# Altium schematic sheet Schematic_Kpad.SchDoc: Kpad
size 431 x 279 mm; ENG_APP_DATE: 04/28/25; DSN_APP_DATE: 04/28/25; CHK_APP_DATE: 04/28/25; ApprovedBy: A Chernyakov; CheckedBy: A Chernyakov; Author: Kai Hokanson; DrawnBy: Kai Hokanson; Engineer: Kai Hokanson; Revision: 1; SheetNumber: 1; SheetTotal: 1; SchematicRevision: 1; CourseNumber: DRAFT 227; CourseTItle: Printed Circuit Board Design II
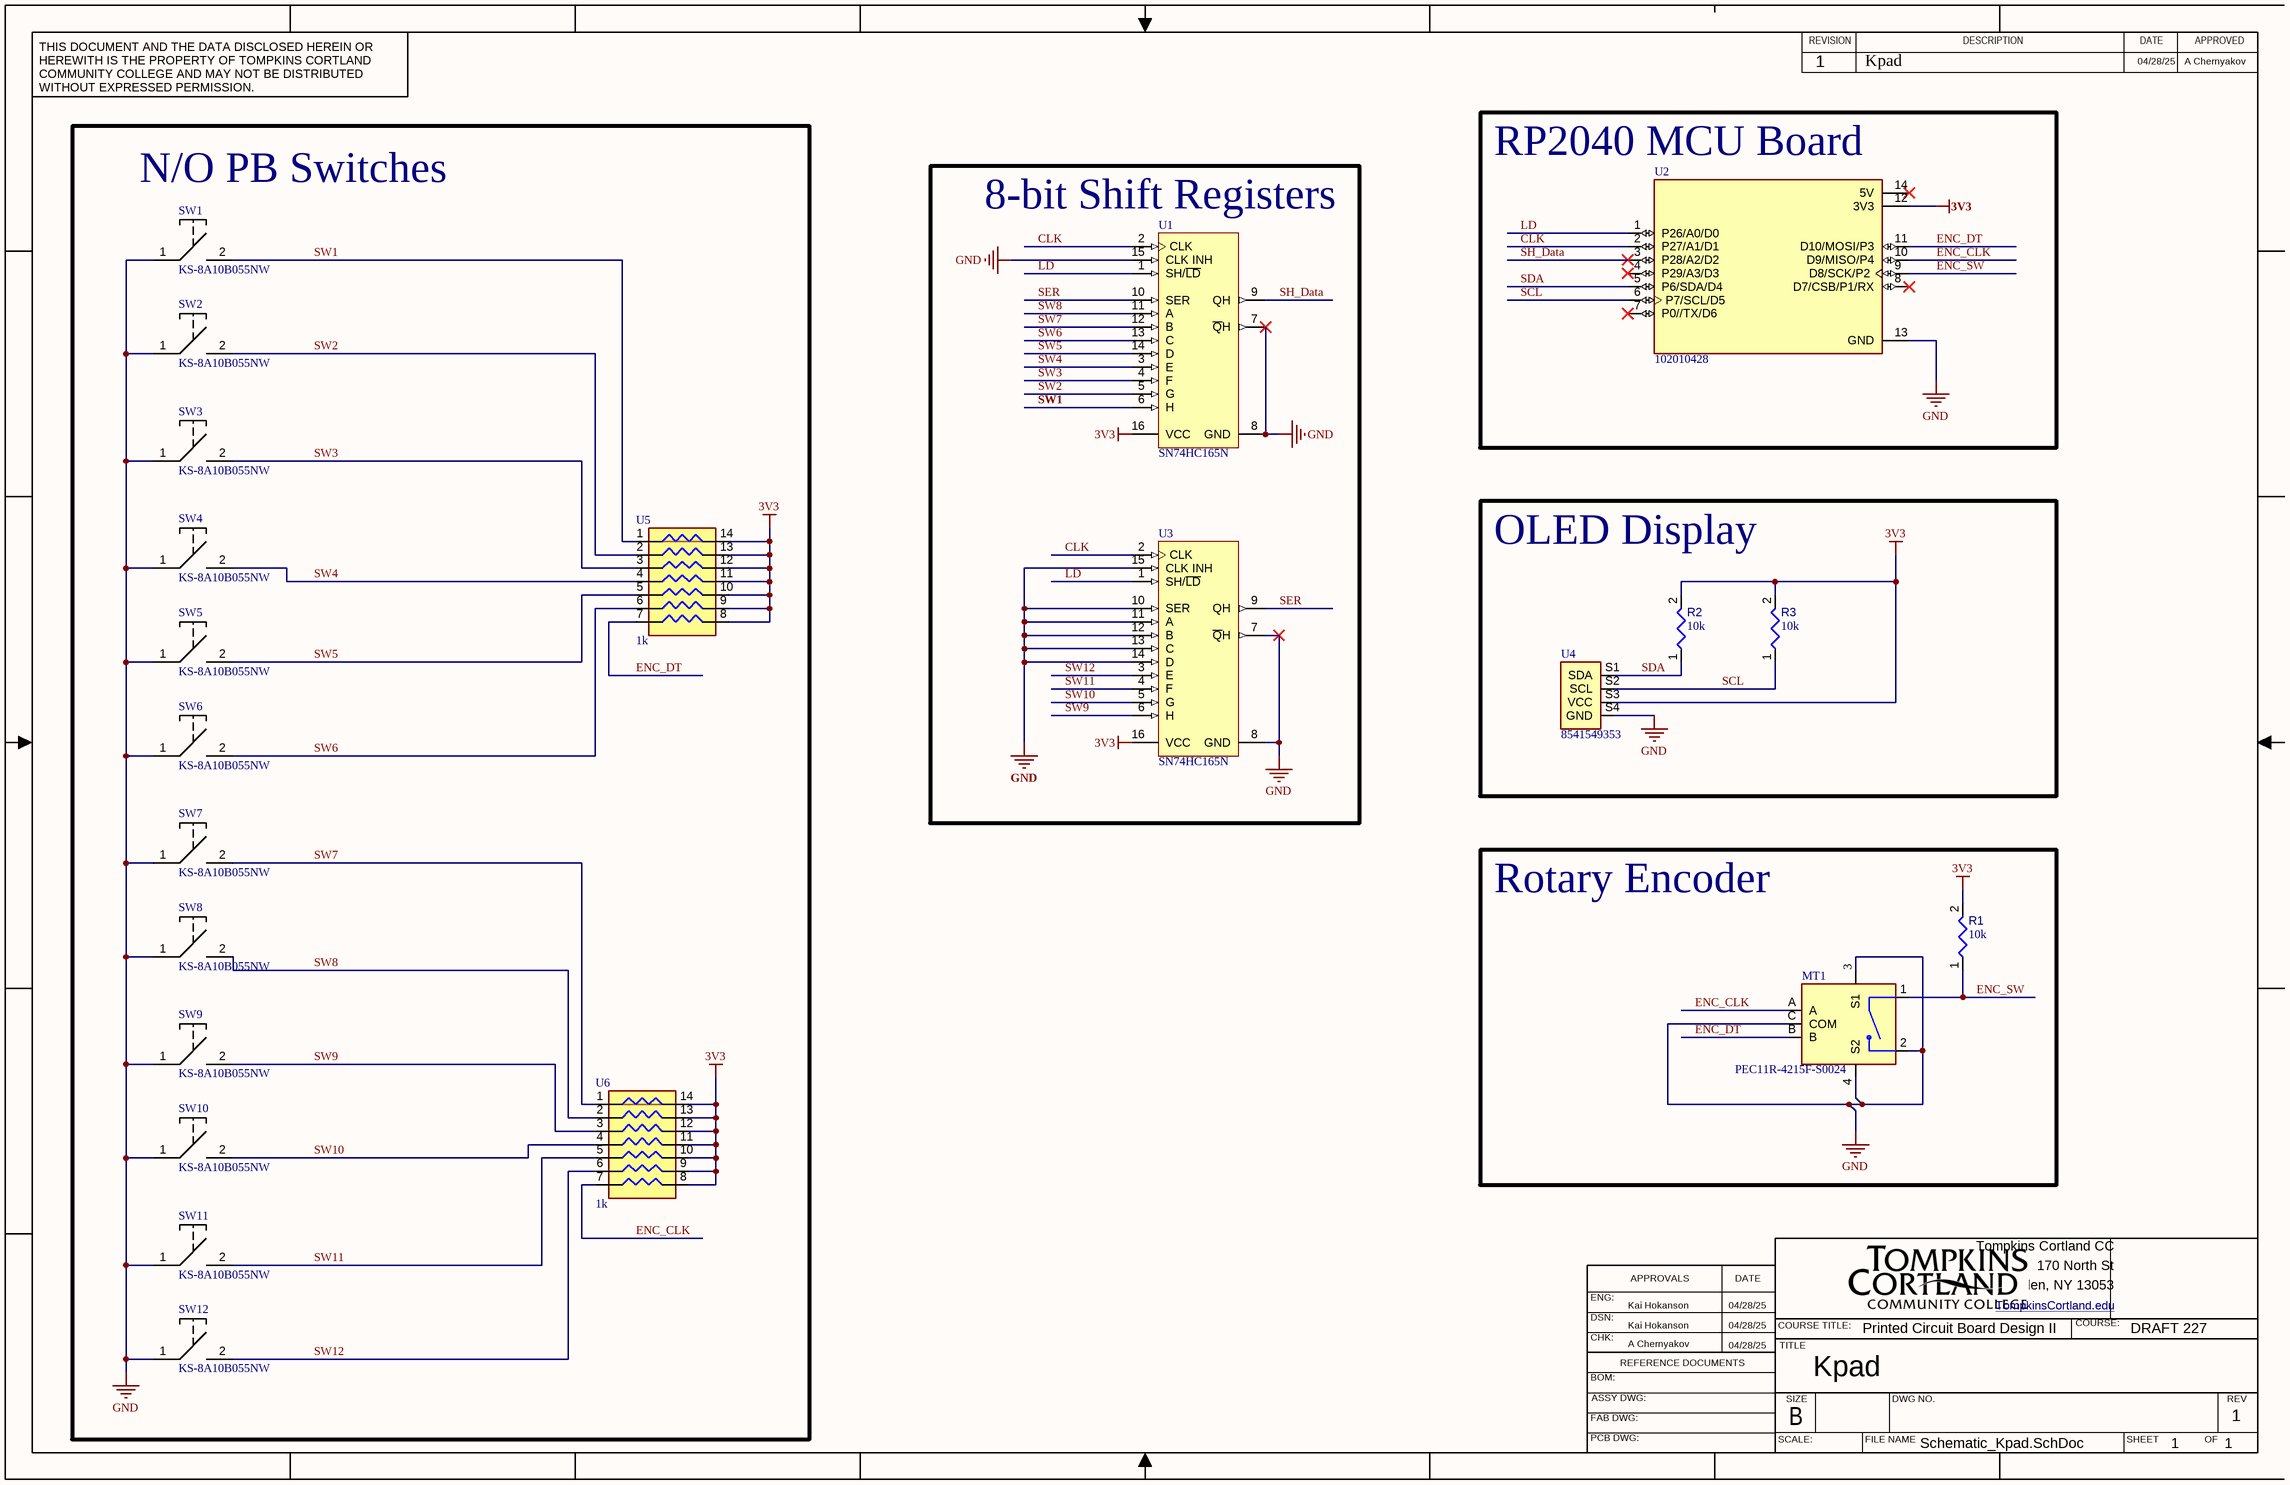
[diagram p0: Schematic_Kpad.SchDoc]

## Parts
MT1  PEC11R-4215F-S0024  [FP-PEC11R-4215F-S0024-MFG]
R1  value 10k  [RESA60-630X240]  (hidden comment: MFR-25FBF52-10K)
R2  value 10k  [RESA60-630X240]  (hidden comment: MFR-25FBF52-10K)
R3  value 10k  [RESA60-630X240]  (hidden comment: MFR-25FBF52-10K)
SW1  KS-8A10B055NW  [KS-8A10B055NW-Footprint-1]
SW2  KS-8A10B055NW  [KS-8A10B055NW-Footprint-1]
SW3  KS-8A10B055NW  [KS-8A10B055NW-Footprint-1]
SW4  KS-8A10B055NW  [KS-8A10B055NW-Footprint-1]
SW5  KS-8A10B055NW  [KS-8A10B055NW-Footprint-1]
SW6  KS-8A10B055NW  [KS-8A10B055NW-Footprint-1]
SW7  KS-8A10B055NW  [KS-8A10B055NW-Footprint-1]
SW8  KS-8A10B055NW  [KS-8A10B055NW-Footprint-1]
SW9  KS-8A10B055NW  [KS-8A10B055NW-Footprint-1]
SW10  KS-8A10B055NW  [KS-8A10B055NW-Footprint-1]
SW11  KS-8A10B055NW  [KS-8A10B055NW-Footprint-1]
SW12  KS-8A10B055NW  [KS-8A10B055NW-Footprint-1]
U1  SN74HC165N  [TI-N0016A]
U2  102010428  [MODULE_102010428]
U3  SN74HC165N  [TI-N0016A]
U4  8541549353  [New footprint 1]
U5  value 1k  [DIP794W45P254L1969H508Q14]  (hidden comment: 4114R-1-102LF)
U6  value 1k  [DIP794W45P254L1969H508Q14]  (hidden comment: 4114R-1-102LF)

## Blocks framed on the sheet
RP2040 MCU Board: U2
N/O PB Switches: SW1-SW12 U5 U6
8-bit Shift Registers: U1 U3
OLED Display: R2 R3 U4
Rotary Encoder: MT1 R1

## Nets
3V3: R1.2 R2.2 R3.2 U1.16(VCC) U2.12(3V3) U3.16(VCC) U4.S3(VCC) U5.8 U5.9 U5.10 U5.11 U5.12 U5.13 U5.14 U6.8 U6.9 U6.10 U6.11 U6.12 U6.13 U6.14
GND: MT1.2 MT1.3(S1) MT1.4(S2) MT1.C(COM) SW1.1 SW2.1 SW3.1 SW4.1 SW5.1 SW6.1 SW7.1 SW8.1 SW9.1 SW10.1 SW11.1 SW12.1 U1.7(~{Q}H) U1.8(GND) U1.15(CLK_INH) U2.13(GND) U3.7(~{Q}H) U3.8(GND) U3.10(SER) U3.11(A) U3.12(B) U3.13(C) U3.14(D) U3.15(CLK_INH) U4.S4(GND)
CLK: U1.2(CLK) U2.2(P27/A1/D1) U3.2(CLK)
ENC_CLK: MT1.A U2.10(D9/MISO/P4) U6.7
ENC_DT: MT1.B U2.11(D10/MOSI/P3) U5.7
ENC_SW: MT1.1 R1.1 U2.9(D8/SCK/P2)
LD: U1.1(SH/~{LD}) U2.1(P26/A0/D0) U3.1(SH/~{LD})
SCL: R3.1 U2.6(P7/SCL/D5) U4.S2(SCL)
SDA: R2.1 U2.5(P6/SDA/D4) U4.S1(SDA)
SER: U1.10(SER) U3.9(QH)
SH_Data: U1.9(QH) U2.3(P28/A2/D2)
SW1: SW1.2 U1.6(H) U5.1
SW2: SW2.2 U1.5(G) U5.2
SW3: SW3.2 U1.4(F) U5.3
SW4: SW4.2 U1.3(E) U5.4
SW5: SW5.2 U1.14(D) U5.5
SW6: SW6.2 U1.13(C) U5.6
SW7: SW7.2 U1.12(B) U6.1
SW8: SW8.2 U1.11(A) U6.2
SW9: SW9.2 U3.6(H) U6.3
SW10: SW10.2 U3.5(G) U6.4
SW11: SW11.2 U3.4(F) U6.5
SW12: SW12.2 U3.3(E) U6.6

Not connected (* = marked no-connect by the designer): U2 4(P29/A3/D3)* 7(P0//TX/D6)* 8(D7/CSB/P1/RX)* 14(5V)*

## Notes on the sheet
- Kpad
- THIS DOCUMENT AND THE DATA DISCLOSED HEREIN OR HEREWITH IS THE PROPERTY OF TOMPKINS CORTLAND COMMUNITY COLLEGE AND MAY NOT BE DISTRIBUTED WITHOUT EXPRESSED PERMISSION.
- REVISION
- DESCRIPTION
- DATE
- APPROVED
- ENG:
- APPROVALS
- 170 North St
- Dryden, NY 13053
- TompkinsCortland.edu <http://TompkinsCortland.edu>
- Tompkins Cortland CC
- DSN:
- CHK:
- REFERENCE DOCUMENTS
- COURSE TITLE:
- TITLE
- COURSE:
- BOM:
- FAB DWG:
- PCB DWG:
- ASSY DWG:
- SCALE:
- SIZE
- B
- FILE NAME
- DWG NO.
- SHEET
- OF
- REV

## Library data of the parts
MT1 = CMP-033-000000-5: Incremental Encoder, 12 Mm, Contact Rating 10 Ma - 5 Vdc; Source: PEC11R-4215F-S0024.SchLib; Component Type: Standard; Package: None; Price: None; Design Item ID: PEC11R-4215F-S0024; Value: *; Pin Count: 7; RoHS Compliant: Yes; Availability: Unavailable; MP: PEC11R-4215F-S0024
R1-R3 = CMP-009-00047-4: Axial Resistor, 10 KOhm, +/- 1%, 0.25 W, -55 to 155 degC, 2-Pin THD, RoHS, Bulk; Manufacturer: Yageo; Power: 250mW; Voltage Rating: 250V; Manufacturer URL: http://www.yageo.com/; Datasheet URL: http://www.yageo.com/documents/recent/Yageo%20LR_MFR_2013.pdf; Package Reference: MFR-25; Min Operating Temperature: -55°C; Mounting Technology: TH; Package Quantity: 200; Case/Package: Axial; Tolerance: 1%; RoHS Compliant: True; Datasheet Version: Apr-13; Packaging: Bulk; Max Operating Temperature: 155°C; Package Description: 2-Pin Axial Lead, Dia 2.4 mm, Body Length 6.3 mm
SW1-SW12 = CMP-011-00015-12: SPST momentary switch 15.40mmx15.40mm; Manufacturer Part Number 1: KS-8A10B055NW-D194; Manufacturer 1: Gateron; Current Rating: 10mA; Voltage Rating: 12V; Pins: 4; Max Current Rating: 10mA; ComponentLink1Description: Datasheet; Min Operating Temperature: -40°C; Max Operating Temperature: 80°C; ComponentLink1URL: https://gateron.com/u_file/2311/10/file/GATERONOilkingswitch-KS-8A10B055NW-D53.pdf; Throw Configuration: SPST; Mounting Technology: TH; Supplier 1: Divinikey; Supplier Part Number 1: DK002607
U1 U3 = CMP-016-00000-4: Parallel-Load Shift Register, 8-Bit, 2 to 6 V, -40 to 125 degC, 16-Pin PDIP (N), Pb-Free (RoHS), Rail/Tube; Manufacturer 1: Texas Instruments; Nominal Supply Voltage: 5V; Elements: 1; Propagation Delay: 150ns; Direction: Unidirectional; Min Supply Voltage: 2V; Max Supply Voltage: 6V; Package Version: 4040049/E, 12/2002; Max Ouput Current: 5.2mA; Datasheet URL: http://www.ti.com/lit/ds/symlink/sn74hc165.pdf; Logic Function: ShiftRegister; Package Reference: PDIP-16; Pins: 16; Package Description: 16-Pin Plastic Double In-line Package, Body 19.305 x 6.35 mm, Pitch 2.54 mm; Manufacturer URL: http://www.ti.com/; Min Operating Temperature: -40°C; Packaging: Rail/Tube; Datasheet Version: SCLS116H, 12/2015; Package Quantity: 25; Package URL: http://www.ti.com/lit/ml/mpdi002c/mpdi002c.pdf; RoHS Compliant: True; Mounting Technology: TH; Case/Package: PDIP; Output Current: 5.2mA; Max Operating Temperature: 85°C; Supplier 1: Digikey; Manufacturer Part Number 1: SN74HC165N; Supplier Part Number 1: 296-8251-5-ND
U2 = CMP-031-000000-3: RP2040 XIAO RP2040 series ARMÂ® CortexÂ®-M0+ MCU 32-Bit Embedded Evaluation Board; Manufacturer 1: Seeed Technology Co., Ltd; Design Item ID: 102010428; MP: 102010428; Value: *; Package: None; Source: 102010428.SchLib; Check_prices: https://www.snapeda.com/parts/102010428/Seeed+Technology+Co.%252C+Ltd/view-part/?ref=eda; SnapEDA_Link: https://www.snapeda.com/parts/102010428/Seeed+Technology+Co.%252C+Ltd/view-part/?ref=snap; Component Type: Standard; Pin Count: 14; Supplier 1: Digikey; Supplier Part Number 1: 1597-102010428-ND; Manufacturer Part Number 1: 102010428
U4 = CMP-003-000002-7: MakerFocus 2pcs I2C OLED Display Module 0.91 Inch; Manufacturer 1: Shenzhen Jin Ma Ding Electronics Co., Ltd.; Manufacturer Part Number 1: QG-2832TLBFG02; Product Manual: https://drive.google.com/file/d/14A_luFwqvZaKu-PKTfJdWmUZ4T4Wk65X/view; Supplier Part Number 1: 8541549353; Supplier 1: MakerFocus
U5 U6 = CMP-009-00186-1: RES ARRAY 7 RES 1K OHM 14DIP; Manufacturer 1: Bourns; Manufacturer Series: 4100R; Lead Length: 3.43mm; Rated Temperature: 70°C; Number of Elements: 1; First Element Resistance: 1kR; Network Type: Isolated; Channels: 7; Tolerance: 2%; Package Height: 4.57mm; Temperature Coefficient Tracking: 50ppm/°C; Power: 250mW; Package Width: 7.87mm; Working Voltage: 100V; Package Length: 19.43mm; Temperature Coefficient: 100ppm/°C; Package Style: DIPMeter; ComponentLink1Description: Datasheet; Component Type: Standard; ComponentLink1URL: https://www.bourns.com/docs/Product-Datasheets/4100R.pdf; Reach SVHC Compliant: No; Technology: METAL GLAZE/THICK FILM; JESD-609 Code: e3; Design Item ID: 4114R-1-102LF; Manufacturer Part Number 1: 4114R-1-102LF; Mounting Technology: Through Hole; Package Shape: Rectangular; Case/Package: 7731; Package: PDIP-14; Series: 4100R; Construction: Molded; Pins: 14; Check_prices: https://www.snapeda.com/parts/SN74LS90N/Texas%20Instruments/view-part/386057/?ref=eda; Termination: Flat; Terminal Finish: Tin; Max Operating Temperature: 125°C; Digi-Key_Part_Number: 4114R-1-102LF-ND; Min Operating Temperature: -55°C; Element Power Dissipation: 250mW; Pin Count: 12; RoHS Compliant: Yes; Lead Pitch: 2.54mm; Resistor Type: ARRAY/NETWORK RESISTOR